# Altium project DATN.PrjPcb
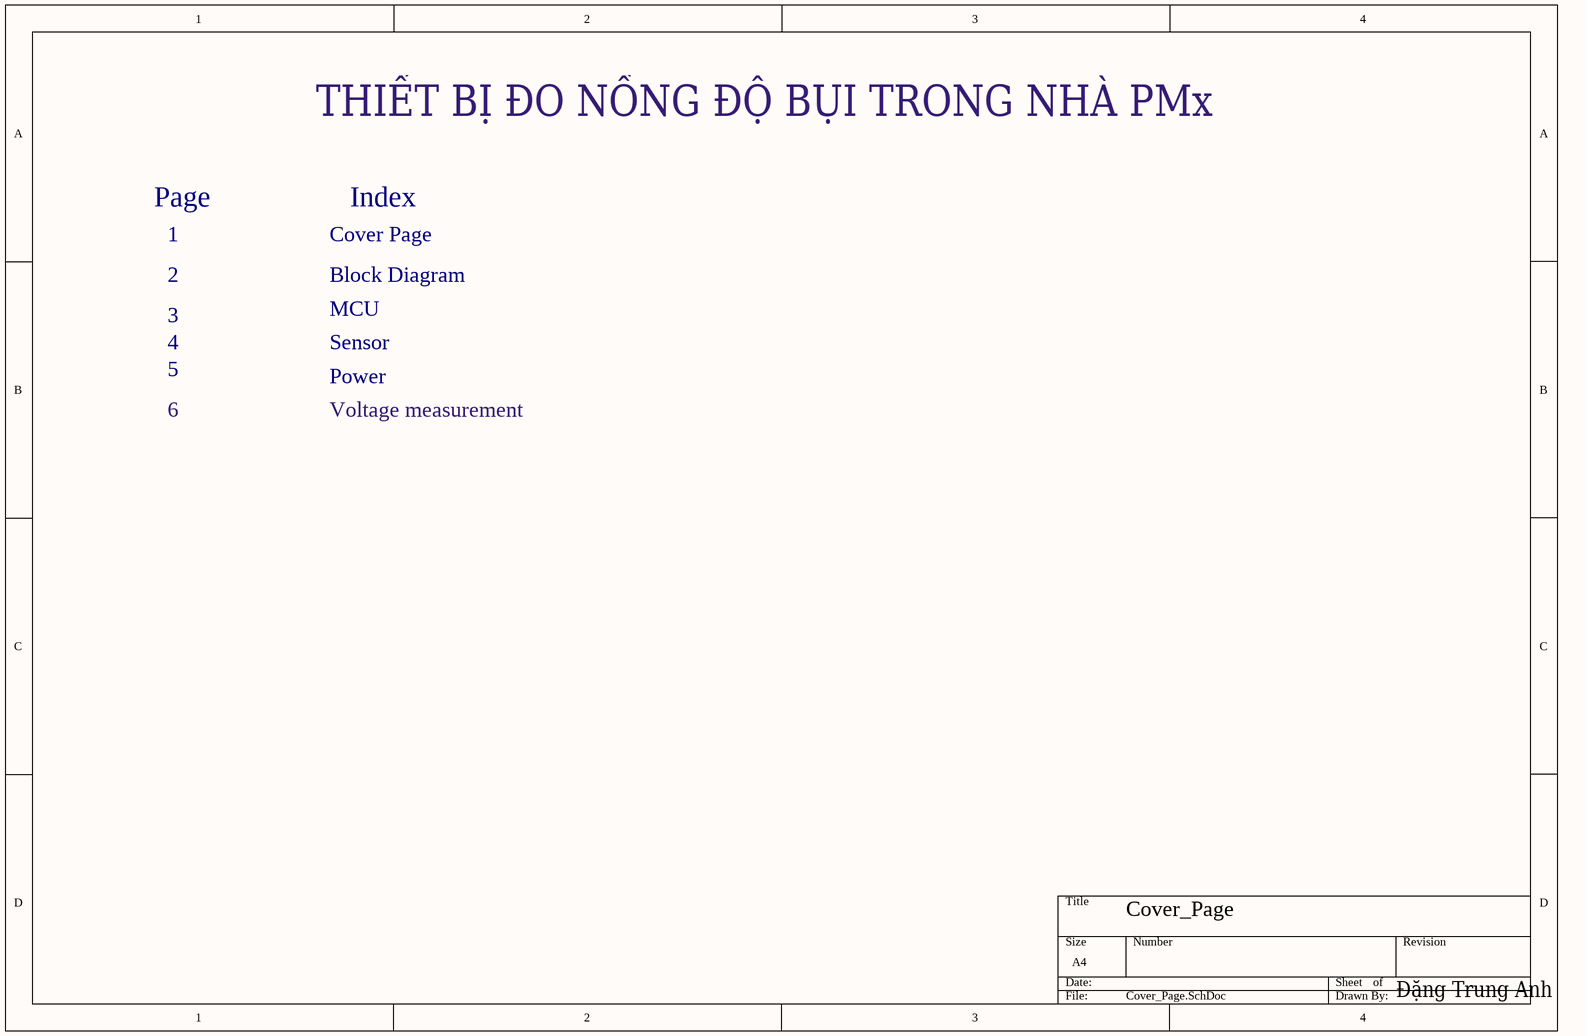
[diagram p0: Cover_Page.SchDoc]
5 sheets, 81 parts. Net scope: hierarchical (ports join the sheet entries above them; power ports are global).
Board file: PCB2.PcbDoc
Sheets:
  Cover_Page.SchDoc
  Block_Diagram.SchDoc
  MCU.SchDoc
    U_Sensor = Sensor.SchDoc
    U_Power = Power.SchDoc

## Sheet Cover_Page.SchDoc
size A4

### Notes on the sheet
- THIẾT BỊ ĐO NỒNG ĐỘ BỤI TRONG NHÀ PMx
- Page
- 1
- Cover Page
- Index
- 2
- Block Diagram
- 3
- 4
- 5
- MCU
- Sensor
- Power
- 6
- Voltage measurement
- Cover_Page
- Đặng Trung Anh

## Sheet Block_Diagram.SchDoc
size A4
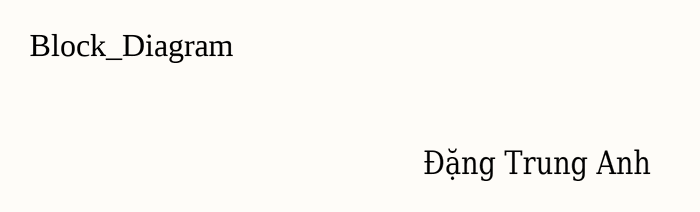
[diagram p1: Block_Diagram.SchDoc]

### Notes on the sheet
- Block_Diagram
- Đặng Trung Anh

## Sheet MCU.SchDoc
size A4
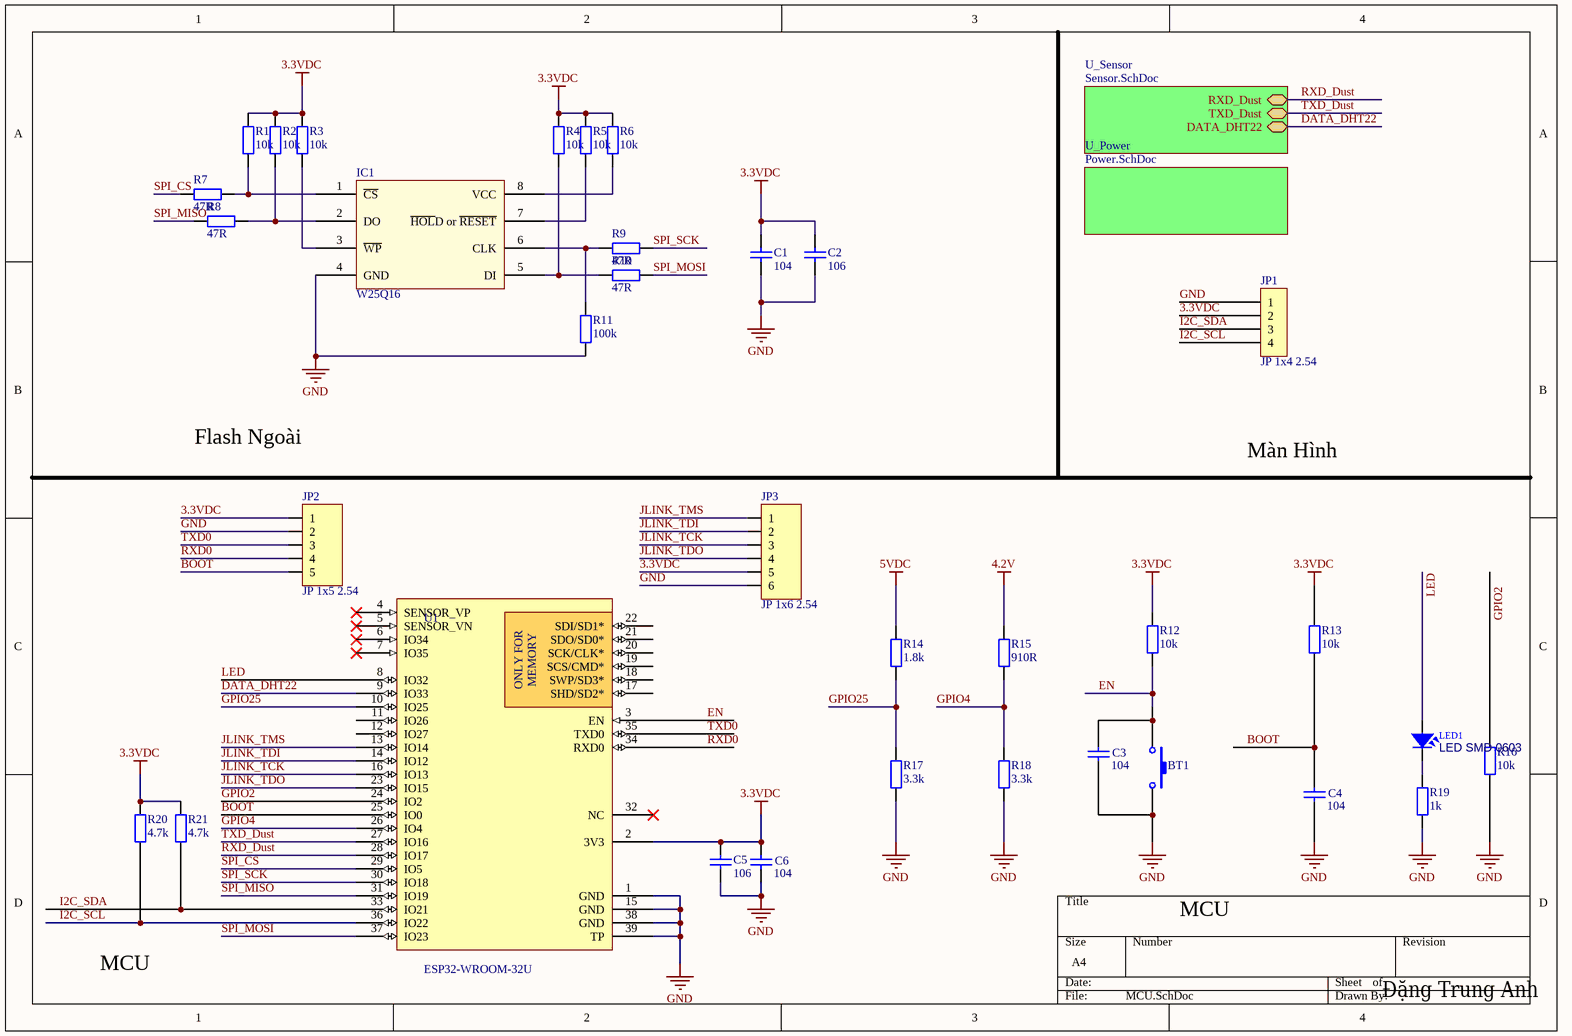
[diagram p2: MCU.SchDoc]

### Parts
BT1  Nut Nhan 2 Chan SMD 3x6x2.5  [Nut Nhan 2 Chan SMD 3x6x2.5]  (value not drawn)
C1  104  [tu 0603]
C2  106  [tu 0603]
C3  104  [tu 0603]
C4  104  [tu 0603]
C5  106  [tu 0603]
C6  104  [tu 0603]
IC1  W25Q16  [W25Q16 -SOIC8]
JP1  JP 1x4 2.54  [JP 1x4 DT]
JP2  JP 1x5 2.54  [JP 1x5 DT]
JP3  JP 1x6 2.54  [JP 1x6 DT]
LED1  LED SMD 0603  [LED-0603-BLUE]
R1  10k  [tro smd 0603]
R2  10k  [tro smd 0603]
R3  10k  [tro smd 0603]
R4  10k  [tro smd 0603]
R5  10k  [tro smd 0603]
R6  10k  [tro smd 0603]
R7  47R  [tro smd 0603]
R8  47R  [tro smd 0603]
R9  47R  [tro smd 0603]
R10  47R  [tro smd 0603]
R11  100k  [tro smd 0603]
R12  10k  [tro smd 0603]
R13  10k  [tro smd 0603]
R14  1.8k  [tro smd 0603]
R15  910R  [tro smd 0603]
R16  10k  [tro smd 0603]
R17  3.3k  [tro smd 0603]
R18  3.3k  [tro smd 0603]
R19  1k  [tro smd 0603]
R20  4.7k  [tro smd 0603]
R21  4.7k  [tro smd 0603]
U1  ESP32-WROOM-32U  [ESP32-WROOM-32]

### Sub-sheets
U_Power = Power.SchDoc: no entries
U_Sensor = Sensor.SchDoc: RXD_Dust (bidir), TXD_Dust (bidir), DATA_DHT22 (bidir)

### Nets
3.3VDC: C1.1 C2.1 C5.1 C6.1 JP1.2 JP2.1 JP3.5 R1.2 R2.2 R3.2 R4.2 R5.2 R6.2 R12.2 R13.2 R20.2 R21.2 U1.2(3V3)
4.2V: R15.2
5VDC: R14.2
GND: BT1.2 C1.2 C2.2 C3.2 C4.2 C5.2 C6.2 IC1.4(GND) JP1.1 JP2.2 JP3.6 R11.1 R16.1 R17.1 R18.1 R19.1 U1.1(GND) U1.15(GND) U1.38(GND) U1.39(TP)
BOOT: C4.1 JP2.5 R13.1 U1.25(IO0)
DATA_DHT22: U1.9(IO33) ; sheet U_Sensor/DATA_DHT22
EN: BT1.1 C3.1 R12.1 U1.3(EN)
GPIO2: R16.2 U1.24(IO2)
GPIO4: R15.1 R18.2 U1.26(IO4)
GPIO25: R14.1 R17.2 U1.10(IO25)
I2C_SCL: JP1.4 R20.1 U1.36(IO22)
I2C_SDA: JP1.3 R21.1 U1.33(IO21)
JLINK_TCK: JP3.3 U1.16(IO13)
JLINK_TDI: JP3.2 U1.14(IO12)
JLINK_TDO: JP3.4 U1.23(IO15)
JLINK_TMS: JP3.1 U1.13(IO14)
LED: LED1.A U1.8(IO32)
RXD0: JP2.4 U1.34(RXD0)
RXD_Dust: U1.28(IO17) ; sheet U_Sensor/RXD_Dust
SPI_CS: R7.1 U1.29(IO5)
SPI_MISO: R8.1 U1.31(IO19)
SPI_MOSI: R10.2 U1.37(IO23)
SPI_SCK: R9.2 U1.30(IO18)
TXD0: JP2.3 U1.35(TXD0)
TXD_Dust: U1.27(IO16) ; sheet U_Sensor/TXD_Dust
NetIC1_1: IC1.1(~{CS}) R1.1 R7.2
NetIC1_2: IC1.2(DO) R2.1 R8.2
NetIC1_3: IC1.3(~{WP}) R3.1
NetIC1_5: IC1.5(DI) R4.1 R10.1
NetIC1_6: IC1.6(CLK) R9.1 R11.2
NetIC1_7: IC1.7(~{HOL}D_or_~{RESET}) R5.1
NetIC1_8: IC1.8(VCC) R6.1
NetLED1_K: LED1.K R19.2

Not connected (* = marked no-connect by the designer): U1 4(SENSOR_VP)* 5(SENSOR_VN)* 6(IO34)* 7(IO35)* 11(IO26) 12(IO27) 17(SHD/SD2*) 18(SWP/SD3*) 19(SCS/CMD*) 20(SCK/CLK*) 21(SDO/SD0*) 22(SDI/SD1*) 32(NC)*

### Notes on the sheet
- Flash Ngoài
- Màn Hình
- MCU
- Đặng Trung Anh
- (in symbol ESP32-WROOM-32U) ONLY FOR; MEMORY

### Library data of the parts
BT1 = Nut Nhan 2 Chan SMD 3x6x2.5: Ma_Hang: MH001036; Ten: Nút Nhấn 2 Chân 3x6x2.5MM SMD
C1 C3 C4 C6 = Tu 0603 104 50V 10%: Dán; Don_Vi: Con; So_Chan: 2; Ten_Linh_Kien: Tụ 0603 104-100nF 10% 50V; Ma_Hang: MH004568; Chung_Loai: Dán; Kieu_Chan: *
C2 C5 = Tu 0603 106 16V 20%: Dán; Don_Vi: Con; So_Chan: 2; Ten_Linh_Kien: Tụ 0603-10uF 20% 16V; Ma_Hang: MH004848; Chung_Loai: Dán; Kieu_Chan: *
JP1 = JP 1x4 2.54 Duc Thang: Cắm; Ten_Linh_Kien: Jump Đơn Đực 2.54MM 1x40P Thẳng 11MM; Don_Vi: Con; Ma_Hang: MH000903; Ghi_Chu: *; Kieu_Chan: *; Chung_Loai: Cắm
JP2 = JP 1x5 2.54 Duc Thang: Cắm; Ten_Linh_Kien: Jump Đơn Đực 2.54MM 1x40P Thẳng 11MM; Don_Vi: Con; Ma_Hang: MH000903; Ghi_Chu: *; Kieu_Chan: *; Chung_Loai: Cắm
JP3 = JP 1x6 2.54 Duc Thang: Cắm; Ten_Linh_Kien: Jump Đơn Đực 2.54MM 1x40P Thẳng 11MM; Don_Vi: Con; Ma_Hang: MH000903; Ghi_Chu: *; Kieu_Chan: *; Chung_Loai: Cắm
LED1 = LED SMD 0603: LED 0603 SMD Green 525nm 350mcd 20mA; Manufacturer 1: Kingbright; Manufacturer Part Number 1: APT1608ZGCK; Material: InGaN; Ratings: 200mcd min; 350 mcd typ @ 20mA; Voltage - Forward (Vf) @ 10mA: 3.1V; Viewing Angle: 120°; Lens Style/Size: Rectangle with Flat Top, 1.2mm x 0.8mm; Voltage - Forward (Vf) @ 20mA: 3.3V; SCDType: source; Package / Case: 0603 (1608 metric); Color: Green; Current - Test: 20mA; Manufacturer 2: Kingbright Company LLC; Manufacturer Part Number 2: APT1608-WAP24; Supplier 1: Mouser; Supplier Part Number 1: 604-APT1608ZGCK; ComponentLink1URL: http://www.mouser.com/ds/2/216/APT1608ZGCK-262051.pdf; ComponentLink1Description: http://www.mouser.com/ds/2/216/APT1608ZGCK-262051.pdf; ComponentLink2Description: APT1608-WAP24 Datasheet; ComponentLink2URL: \\SVFI2\PBLShare\Eng\Electrical Engineering\Hardware\Altium\Libraries and Templates\Unreleased Components\Part Number Request 2013-10-02\APT1608-WAP24(Ver.1B).pdf
R1-R6 R12 R13 R16 = Tro 0603 1% 10k: Dán; Don_Vi: Con; So_Chan: 2; Ten_Linh_Kien: Trở 0603 1% 10k; Ma_Hang: MH006333; Chung_Loai: Dán; Kieu_Chan: *
R7-R10 = Tro 0603 1% 47R: Dán; Don_Vi: Con; So_Chan: 2; Ten_Linh_Kien: Trở 0603 1% 0R; Ma_Hang: MH005792; Chung_Loai: Dán; Kieu_Chan: *
R11 = Tro 0603 5% 100k: Dán; So_Chan: 2; Ten_Linh_Kien: Trở 0603 5% 100k; Ma_Hang: MH006314; Don_Vi: Con; Chung_Loai: Dán; Kieu_Chan: *
R14 = Tro 0603 1% 1.8k: Dán; Don_Vi: Con; So_Chan: 2; Ten_Linh_Kien: Trở 0603 1% 0R; Ma_Hang: MH005792; Chung_Loai: Dán; Kieu_Chan: *
R15 = Tro 0603 1% 910R: Dán; Don_Vi: Con; So_Chan: 2; Ten_Linh_Kien: Trở 0603 1% 0R; Ma_Hang: MH005792; Chung_Loai: Dán; Kieu_Chan: *
R17 R18 = Tro 0603 5% 3.3k: Dán; Don_Vi: Con; So_Chan: 2; Ten_Linh_Kien: Trở 0603 5% 3.3k; Ma_Hang: MH006332; Chung_Loai: Dán; Kieu_Chan: *
R19 = Tro 0603 5% 1k: Dán; Don_Vi: Con; So_Chan: 2; Ten_Linh_Kien: Trở 0603 5% 1k; Ma_Hang: MH006319; Chung_Loai: Dán; Kieu_Chan: *
R20 R21 = Tro 0603 5% 4.7k: Dán; Don_Vi: Con; So_Chan: 2; Ten_Linh_Kien: Trở 0603 5% 4.7k; Ma_Hang: MH006327; Chung_Loai: Dán; Kieu_Chan: *
U1 = ESP32-WROOM-32U: Wi-Fi/BT BLE Module ESP32-D0WD; MFR: Espressif; Solder: SMT; Price: None; Value: ESP32-WROOM-32U; Category: MODULE; MPN: ESP32-WROOM-32U; PinCount: 40

## Sheet Sensor.SchDoc
size A4
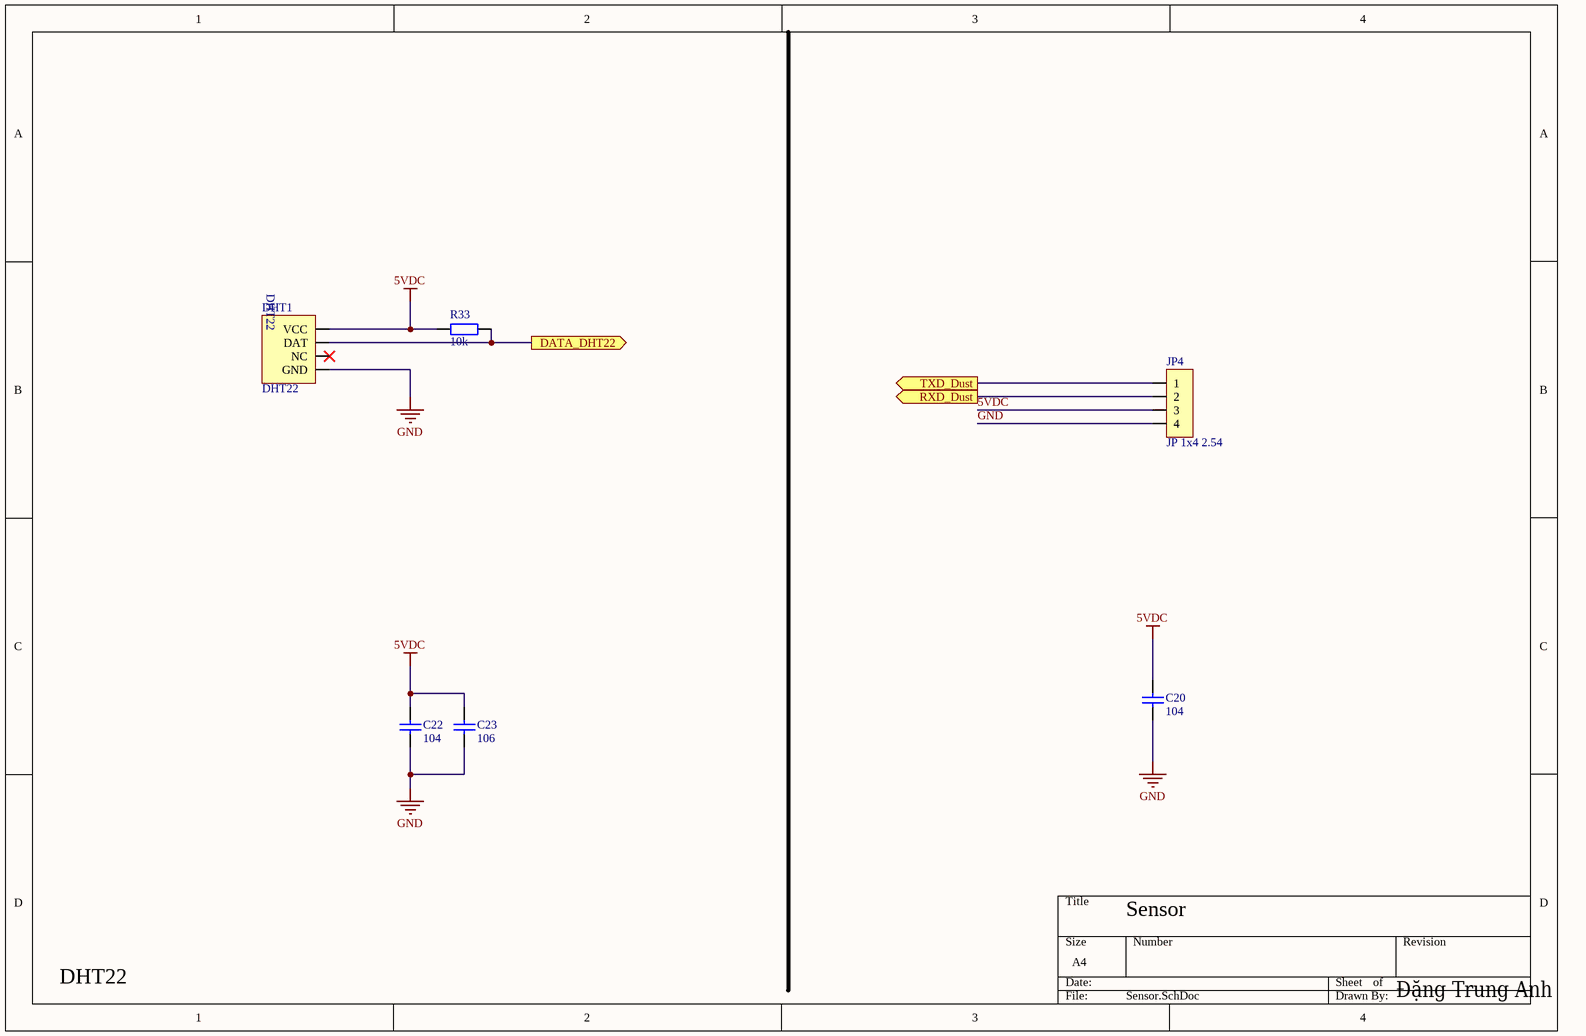
[diagram p3: Sensor.SchDoc]

### Parts
C20  104  [tu 0603]
C22  104  [tu 0603]
C23  106  [tu 0603]
DHT1  DHT22  [DHT22]
JP4  JP 1x4 2.54  [JP 1x4 DC]
R33  10k  [tro smd 0603]

### Ports
DATA_DHT22 (out), RXD_Dust (out), TXD_Dust (out)

### Nets
5VDC: C20.1 C22.1 C23.1 DHT1.1(VCC) JP4.3 R33.2
GND: C20.2 C22.2 C23.2 DHT1.4(GND) JP4.4
DATA_DHT22: DHT1.2(DAT) R33.1 ; port DATA_DHT22
RXD_Dust: JP4.2 ; port RXD_Dust
TXD_Dust: JP4.1 ; port TXD_Dust

Not connected (* = marked no-connect by the designer): DHT1 3(NC)*

### Notes on the sheet
- Sensor
- DHT22
- Đặng Trung Anh

### Library data of the parts
C20 C22 = Tu 0603 104 50V 10%: as C1 on sheet MCU; Chung_Loai: Dán; Kieu_Chan: *
C23 = Tu 0603 106 16V 20%: as C2 on sheet MCU; Chung_Loai: Dán; Kieu_Chan: *
DHT1 = DHT22: Manufacturer: W¨¹rth Elektronik eiSos GmbH; partNo: 613004143121; ComponentLink1 Description: Manufacturer; ComponentLink2 Description: Datasheet; NoPins: 04; Created Date: 29 March 2013; ComponentLink1URL: http://www.we-online.com; ComponentLink2URL: http://katalog.we-online.de/em/datasheet/6130xx143121.pdf; Created by: Karrer Zheng
JP4 = JP 1x4 2.54 Duc Cong: Cắm; Ten_Linh_Kien: Jump Đơn Đực 2.54MM 1x40P Cong Đứng; Don_Vi: Con; Ma_Hang: MH000904; Ghi_Chu: *; Kieu_Chan: *; Chung_Loai: Cắm
R33 = Tro 0603 1% 10k: as R1 on sheet MCU; Chung_Loai: Dán; Kieu_Chan: *

## Sheet Power.SchDoc
size A4
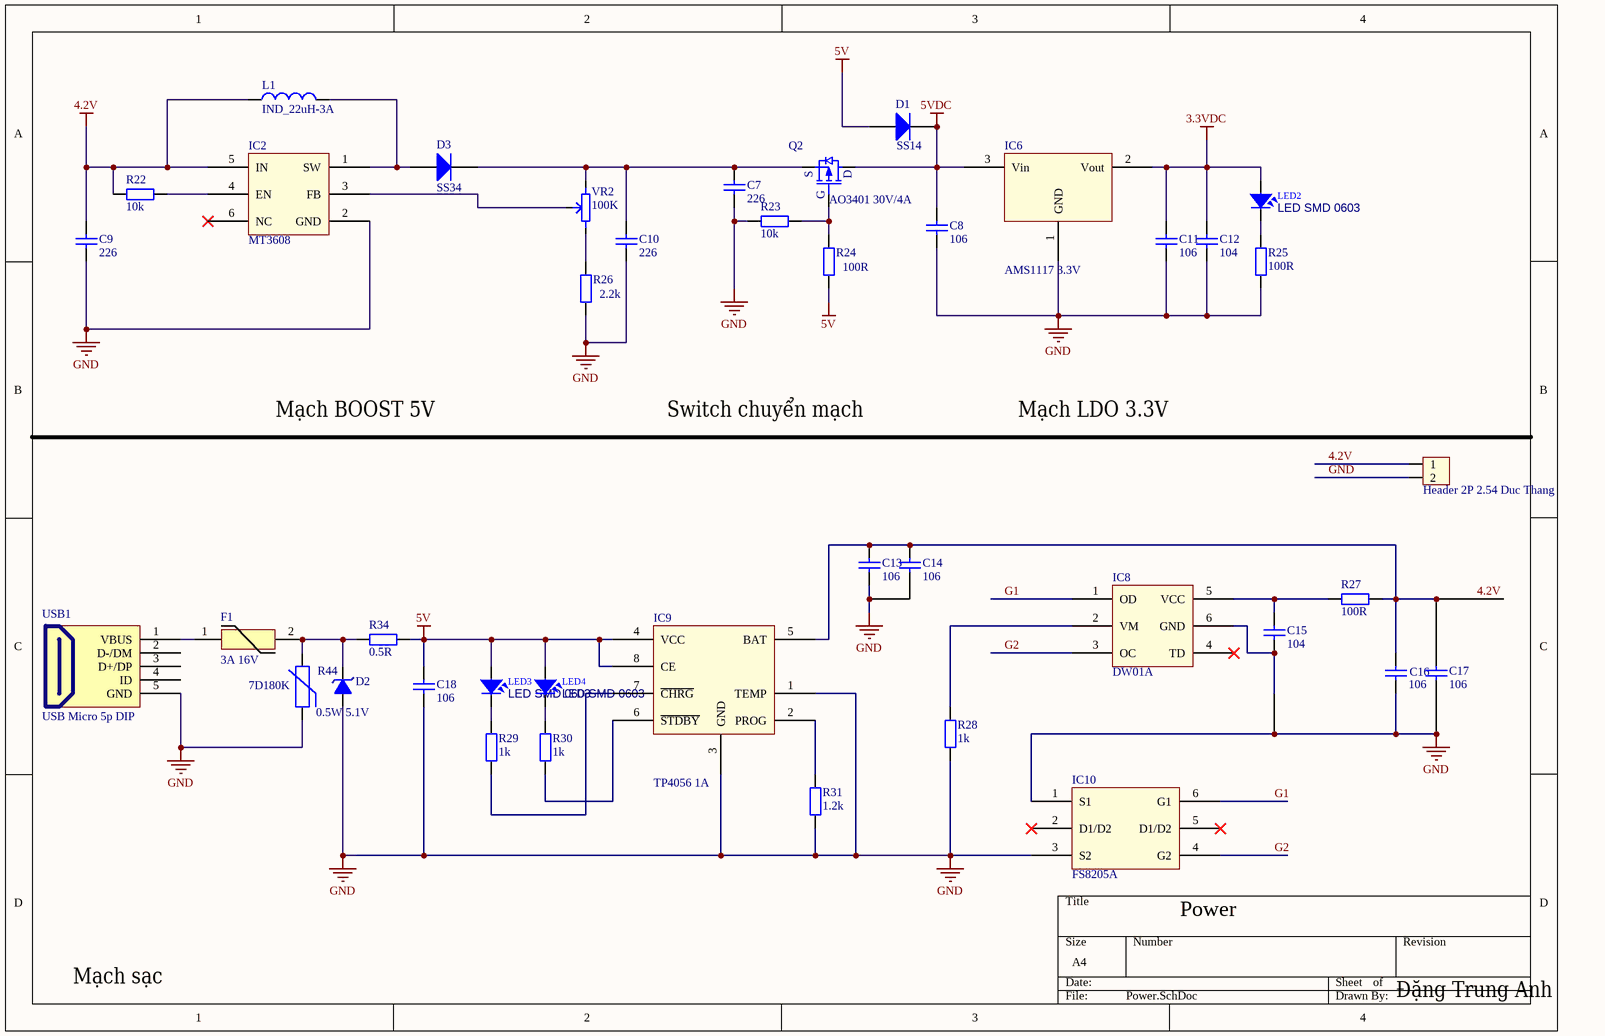
[diagram p4: Power.SchDoc]

### Parts
C7  226  [tu 0603]
C8  106  [tu 0603]
C9  226  [tu 0603]
C10  226  [tu 0603]
C11  106  [tu 0603]
C12  104  [tu 0603]
C13  106  [tu 0603]
C14  106  [tu 0603]
C15  104  [tu 0603]
C16  106  [tu 0603]
C17  106  [tu 0603]
C18  106  [tu 0603]
D1  SS14  [DIODE SMA]
D2  0.5W 5.1V  [DIODE ZENNER SMD SOD80]
D3  SS34  [DIODE SMA]
F1  3A 16V  [FUSE-RUEF250U-2]
H1  Header 2P 2.54 Duc Thang  [XH2.54M-2]
IC2  MT3608  [SOT23-6A]
IC6  AMS1117 3.3V  [SOT223]
IC8  DW01A  [SOT23127P600-8N]
IC9  TP4056 1A  [SOP8]
IC10  FS8205A  [SOT-23-6L]
L1  IND_22uH-3A  [IND_22_10X10_SMD]
LED2  LED SMD 0603  [LED-0603-RED]
LED3  LED SMD 0603  [LED-0603-RED]
LED4  LED SMD 0603  [LED-0603-BLUE]
Q2  AO3401 30V/4A  [SOT23_3]
R22  10k  [tro smd 0603]
R23  10k  [tro smd 0603]
R24  100R  [tro smd 0603]
R25  100R  [tro smd 0603]
R26  2.2k  [tro smd 0603]
R27  100R  [tro smd 0603]
R28  1k  [tro smd 0603]
R29  1k  [tro smd 0603]
R30  1k  [tro smd 0603]
R31  1.2k  [tro smd 0603]
R34  0.5R  [tro smd 0805]
R44  7D180K  [VARISTOR-7D180K]
USB1  USB Micro 5p DIP  [USB Micro 5p DIP]
VR2  100K  [Bien Tro Tam Giac Dung]

### Nets
3.3VDC: C11.1 C12.1 IC6.2(Vout) LED2.A
4.2V: C9.1 C13.1 C14.1 C16.1 C17.1 H1.1 IC2.5(IN) IC9.5(BAT) L1.1 R22.1 R27.1
5V: C18.1 D1.1(A) IC9.4(VCC) IC9.8(CE) LED3.A LED4.A R24.1 R34.2
5VDC: C8.1 D1.2(K) IC6.3(Vin) Q2.3(D)
GND: C7.2 C8.2 C9.2 C10.2 C11.2 C12.2 C13.2 C14.2 C15.2 C16.2 C17.2 C18.2 D2.1(A) H1.2 IC2.2(GND) IC6.1(GND) IC8.6(GND) IC9.1(TEMP) IC9.3(GND) IC10.1(S1) IC10.3(S2) R23.1 R25.1 R26.1 R28.1 R31.1 R44.1 USB1.5(GND)
G1: IC8.1(OD) IC10.6(G1)
G2: IC8.3(OC) IC10.4(G2)
NetC7_1: C7.1 C10.1 D3.2(K) Q2.2(S) VR2.3
NetC15_1: C15.1 IC8.5(VCC) R27.2
NetD2_2: D2.2(K) F1.2 R34.1 R44.2
NetD3_1: D3.1(A) IC2.1(SW) L1.2
NetF1_1: F1.1 USB1.1(VBUS)
NetIC2_3: IC2.3(FB) VR2.2
NetIC2_4: IC2.4(EN) R22.2
NetIC8_2: IC8.2(VM) R28.2
NetIC9_2: IC9.2(PROG) R31.2
NetIC9_6: IC9.6(~{STDBY}) R30.1
NetIC9_7: IC9.7(~{CHRG}) R29.1
NetLED2_K: LED2.K R25.2
NetLED3_K: LED3.K R29.2
NetLED4_K: LED4.K R30.2
NetQ2_1: Q2.1(G) R23.2 R24.2
NetR26_2: R26.2 VR2.1

Not connected (* = marked no-connect by the designer): IC2 6(NC)*; IC8 4(TD)*; IC10 2(D1/D2)* 5(D1/D2)*; USB1 2(D-/DM) 3(D+/DP) 4(ID)

### Notes on the sheet
- Mạch BOOST 5V
- Switch chuyển mạch
- Mạch LDO 3.3V
- (near IC10) Power
- Mạch sạc
- Đặng Trung Anh

### Library data of the parts
C7 C9 C10 = Tu 0603 226 6.3V 10%: Dán; Don_Vi: Con; So_Chan: 2; Ten_Linh_Kien: Tụ 0603 101-0.1nF 10% 50V; Ma_Hang: MH004565; Chung_Loai: Dán; Kieu_Chan: *
C8 C11 C13 C14 C16-C18 = Tu 0603 106 16V 20%: as C2 on sheet MCU; Chung_Loai: Dán; Kieu_Chan: *
C12 C15 = Tu 0603 104 50V 10%: as C1 on sheet MCU; Chung_Loai: Dán; Kieu_Chan: *
D1 = Diode SS14 ( 1N5819): Dán; Ma_Hang: MH002211; Don_Vi: Con; Ten_Linh_Kien: Diode SS14 DO214 Schottky 1A 40V ( 1N5819 DO214); Chung_Loai: Dán; Ghi_Chu: *; Kieu_Chan: *
D2 = Diode Zener 5.1V: Dán; Ma_Hang: MH002881; Ten_Linh_Kien: Diode Zener 1/2W 5.1V SMD1206 ZMM5.1; Don_Vi: Con; Kieu_Chan: *; Ghi_Chu: *; Chung_Loai: Dán
D3 = Diode SS34 ( 1N5822 ): Dán; Don_Vi: Con; Ma_Hang: MH002104; Ten_Linh_Kien: Diode SS34 3A 40V SMA ( 1N5822 SS34A); Kieu_Chan: *; Chung_Loai: Dán
F1 = Cau chi tu phuc hoi 3A 16V: FUSE POLYSWITCH RUE SERIES 3A 16V; MPN: RUEF250U-2; CompanyID: VT-00891; Solder: WAVE; Value: 30V/2.5A
H1 = Header 2P 2.54 Duc Thang: Cắm; Ten_Linh_Kien: Header 2P XH2.54-2P Đực Thẳng; Don_Vi: Con; Ma_Hang: MH001283; Chung_Loai: Cắm
IC2 = MT3608_Boost
L1 = IND_22uH-3A-30%-SMD_1: Fixed Inductors MSS1038 SMT Shielded 15 uH 20 % 3.8 A; Manufacturer: Bourns; Manufacturer Part Number: MSS1038-153MLC; Alternate Part Number-1: NA; Case/Package: SMD; Supplier-1: COILCRAFT SAMPLE; Supplier Part Number-1: MSS1038-153MLC
LED2-LED4 = LED SMD 0603: as LED1 on sheet MCU; Package / Case: 0603 (1608 metric); Color: Green; Current - Test: 20mA; Manufacturer 2: Kingbright Company LLC; Manufacturer Part Number 2: APT1608-WAP24; Supplier 1: Mouser; Supplier Part Number 1: 604-APT1608ZGCK; ComponentLink1URL: http://www.mouser.com/ds/2/216/APT1608ZGCK-262051.pdf; ComponentLink1Description: http://www.mouser.com/ds/2/216/APT1608ZGCK-262051.pdf; ComponentLink2Description: APT1608-WAP24 Datasheet; ComponentLink2URL: \\SVFI2\PBLShare\Eng\Electrical Engineering\Hardware\Altium\Libraries and Templates\Unreleased Components\Part Number Request 2013-10-02\APT1608-WAP24(Ver.1B).pdf
Q2 = AO3401: MOSFET P-CH 30V 4A SOT23; MPN: AO3415; MFR: Alpha & Omega Semiconductor Inc.; Value: 20V/4A; Solder: SMT
R22 R23 = Tro 0603 5% 10k: Dán; Don_Vi: Con; So_Chan: 2; Ten_Linh_Kien: Trở 0603 5% 10k; Ma_Hang: MH006316; Chung_Loai: Dán; Kieu_Chan: *
R24 R25 R27 = Tro 0603 5% 100R: Dán; Don_Vi: Con; So_Chan: 2; Ten_Linh_Kien: Trở 0603 5% 100R; Ma_Hang: MH006315; Chung_Loai: Dán; Kieu_Chan: *
R26 = Tro 0603 5% 2.2k: Dán; Don_Vi: Con; So_Chan: 2; Ten_Linh_Kien: Trở 0603 5% 2.2k; Ma_Hang: MH006321; Chung_Loai: Dán; Kieu_Chan: *
R28-R30 = Tro 0603 5% 1k: as R19 on sheet MCU; Chung_Loai: Dán; Kieu_Chan: *
R31 = Tro 0603 1% 1.2k: Dán; Don_Vi: Con; So_Chan: 2; Ten_Linh_Kien: Trở 0603 1% 0R; Ma_Hang: MH005792; Chung_Loai: Dán; Kieu_Chan: *
R34 = Tro 0805 5% 0.5R: Dán; Don_Vi: Con; So_Chan: 2; Ten_Linh_Kien: Trở 0805 5% 0.5R; Ma_Hang: MH005303; Chung_Loai: Dán; Kieu_Chan: *
R44 = Varistor 7D180K: VARISTOR 7V 18A DISC 7MM; MPN: V47ZA1P; Solder: WAVE; Value: 47V/250A; CompanyID: VT-00888; Category: VARISTOR
USB1 = USB Micro 5p DIP: USB Type B; Ten: MicroUSB MK5P DIP; Ma_Hang: MH005145
VR2 = Bien tro tam giac 100K Dung: Cắm; Don_Vi: Con; Ten_Linh_Kien: Biến Trở Tam Giác 104-100K RM065; Ma_Hang: MH003711; Chung_Loai: Cắm; Ghi_Chu: *; Kieu_Chan: *

## Nets that join several sheets
3.3VDC: MCU (18 pins), Power (C11.1 C12.1 IC6.2 LED2.A)
4.2V: MCU (R15.2), Power (11 pins)
5VDC: MCU (R14.2), Sensor (6 pins), Power (C8.1 D1.2 IC6.3 Q2.3)
GND: MCU (20 pins), Sensor (5 pins), Power (28 pins)
DATA_DHT22: MCU (U1.9), Sensor (DHT1.2 R33.1)
RXD_Dust: MCU (U1.28), Sensor (JP4.2)
TXD_Dust: MCU (U1.27), Sensor (JP4.1)